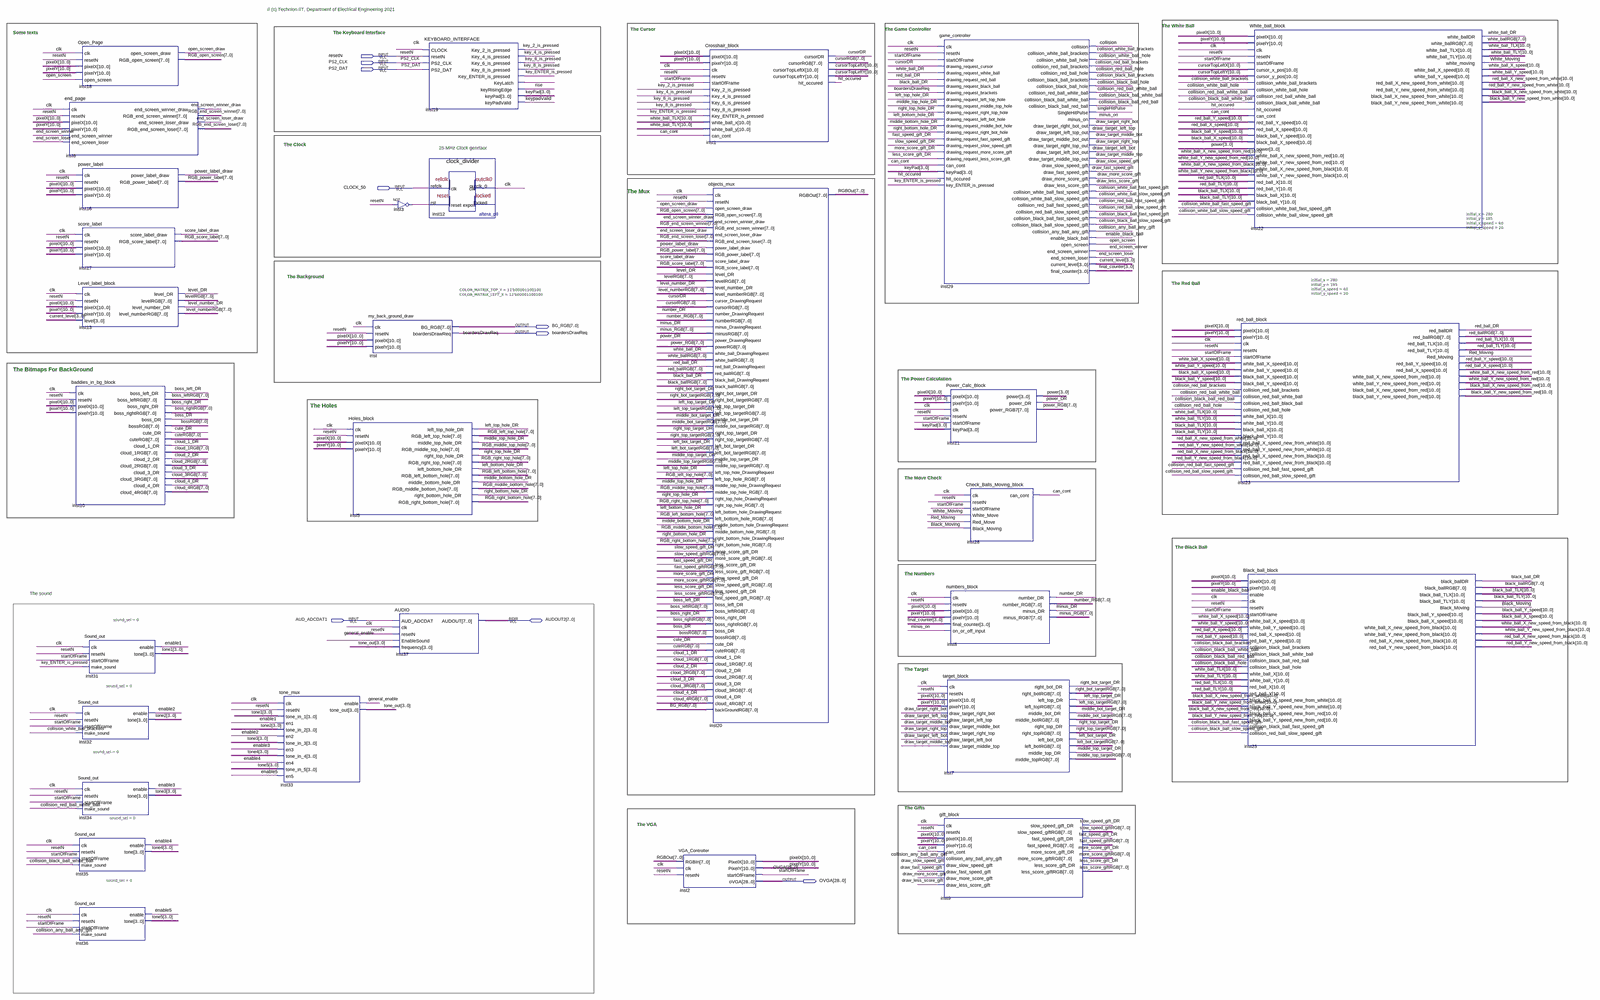
[diagram p0: schematic sheet, whole]
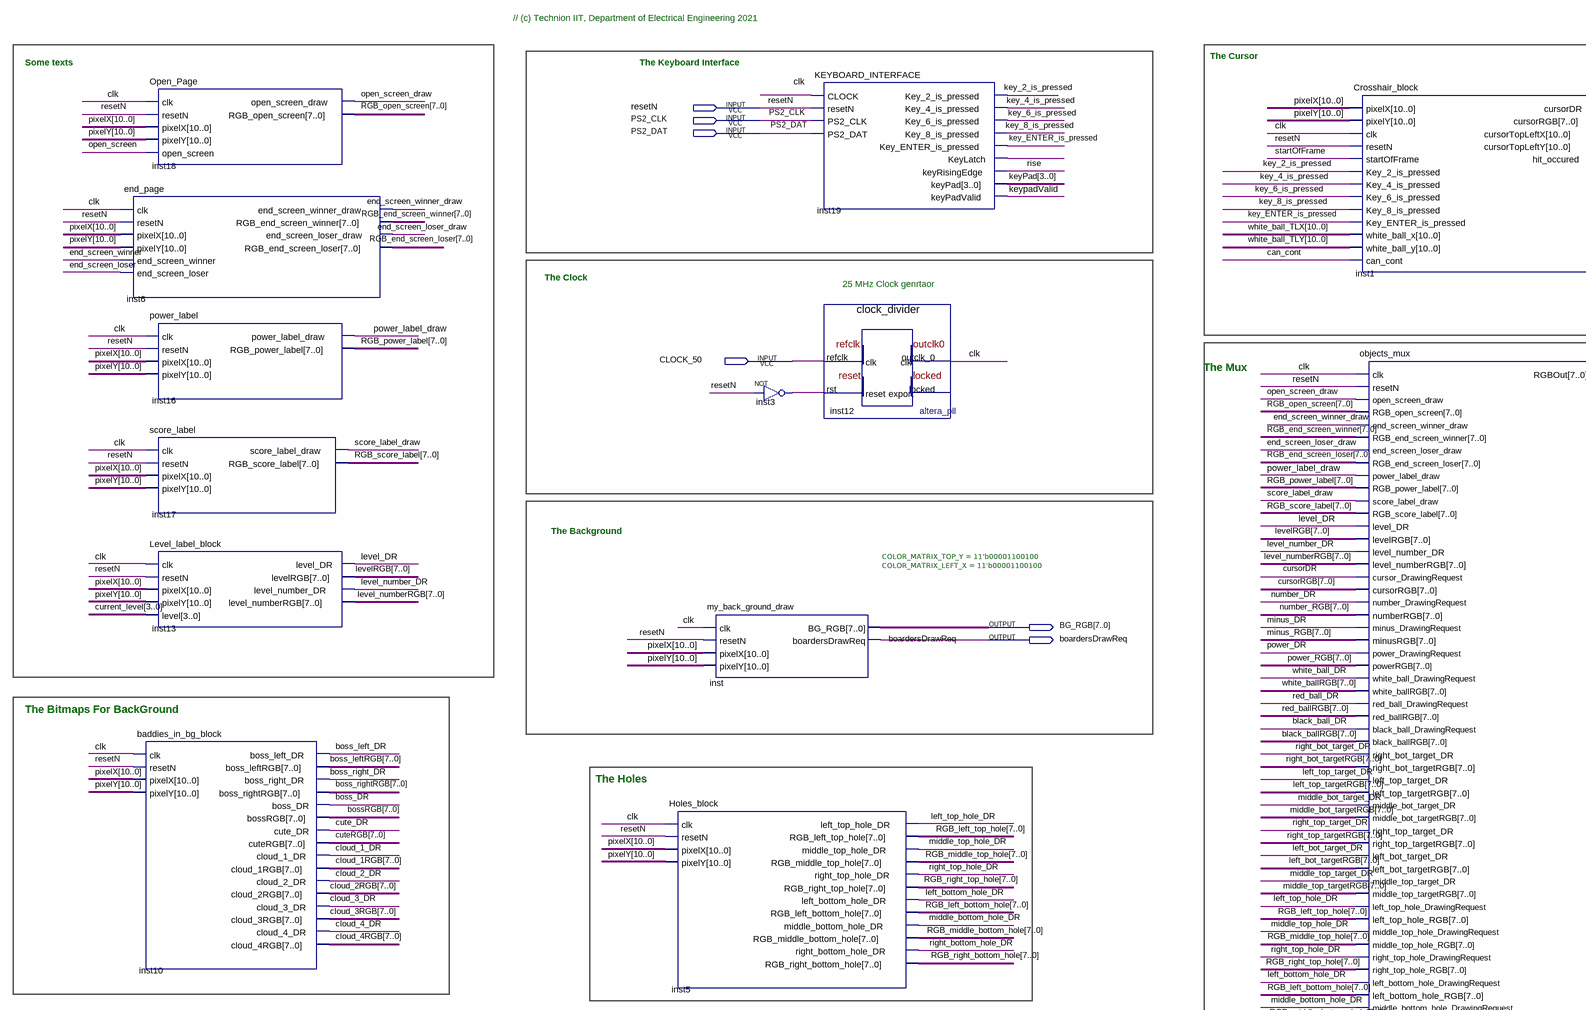
[diagram p1: schematic sheet, upper left part]
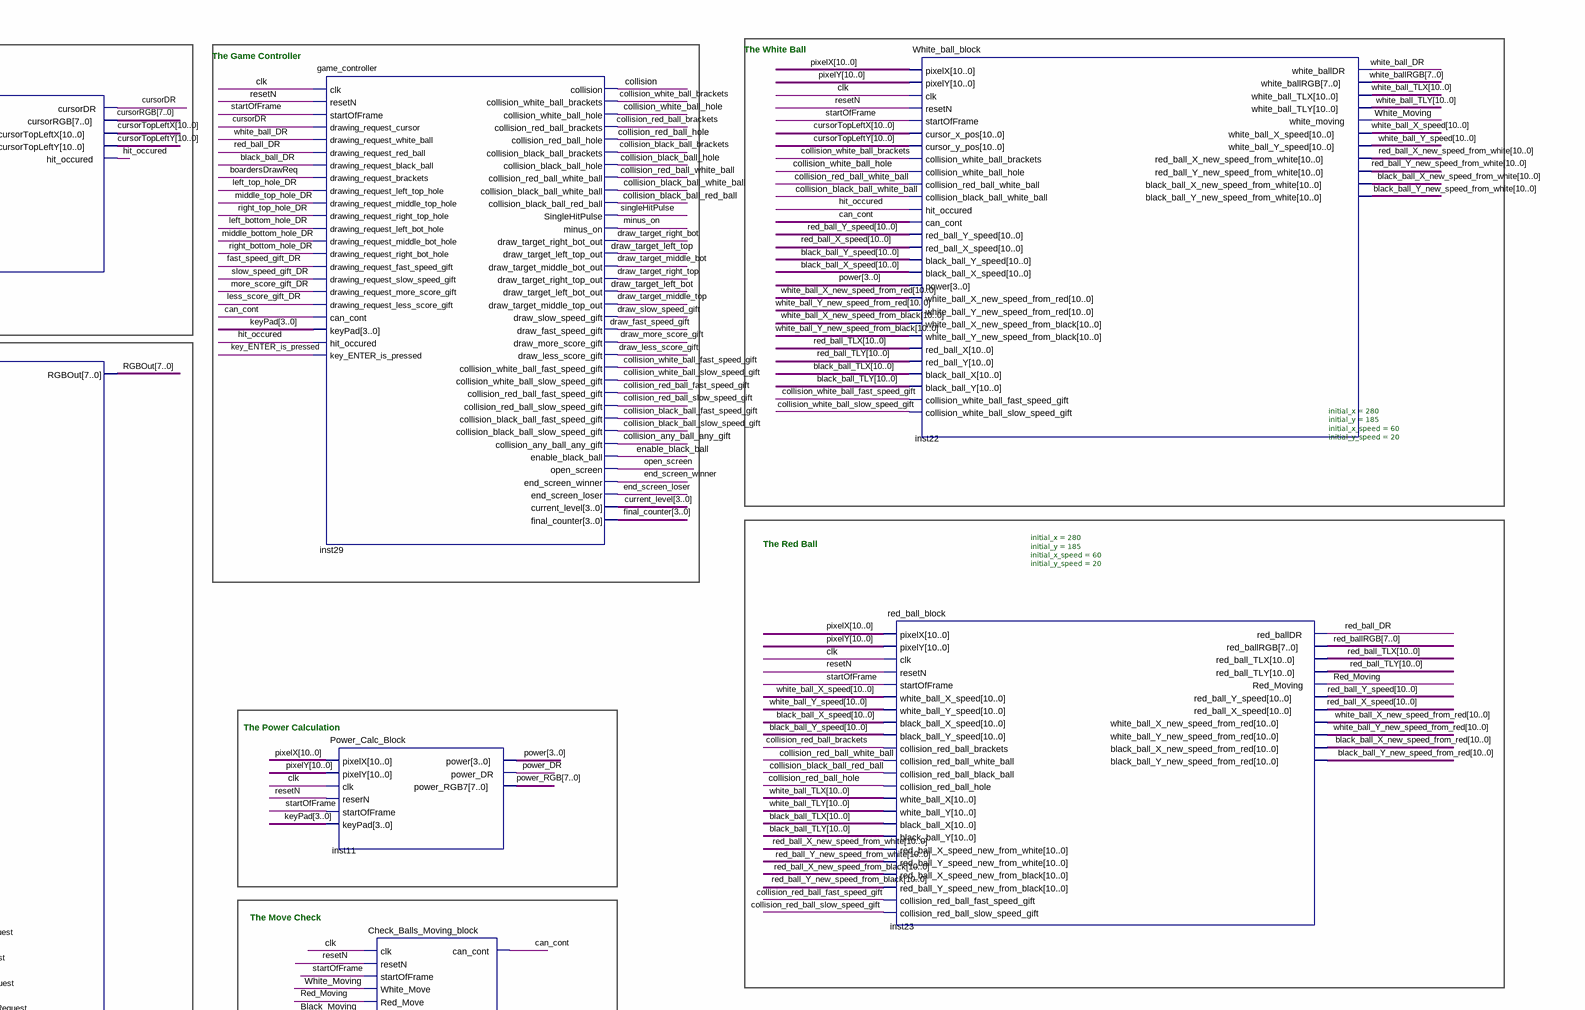
[diagram p2: schematic sheet, upper right part]
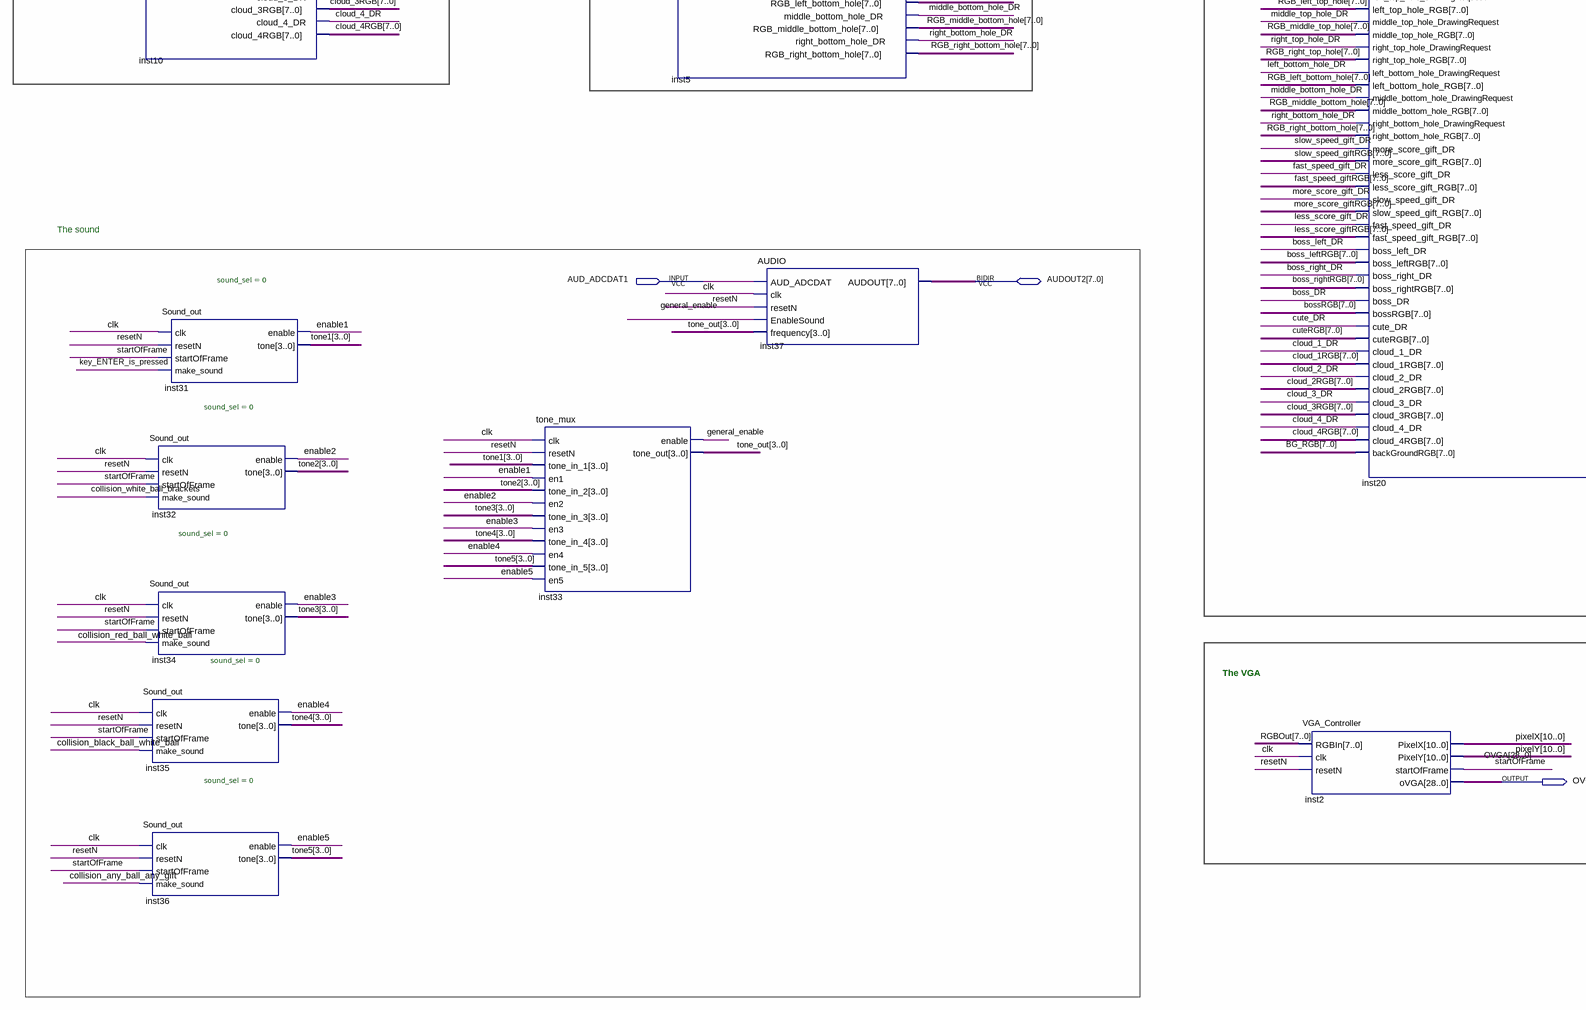
[diagram p3: schematic sheet, lower left part]
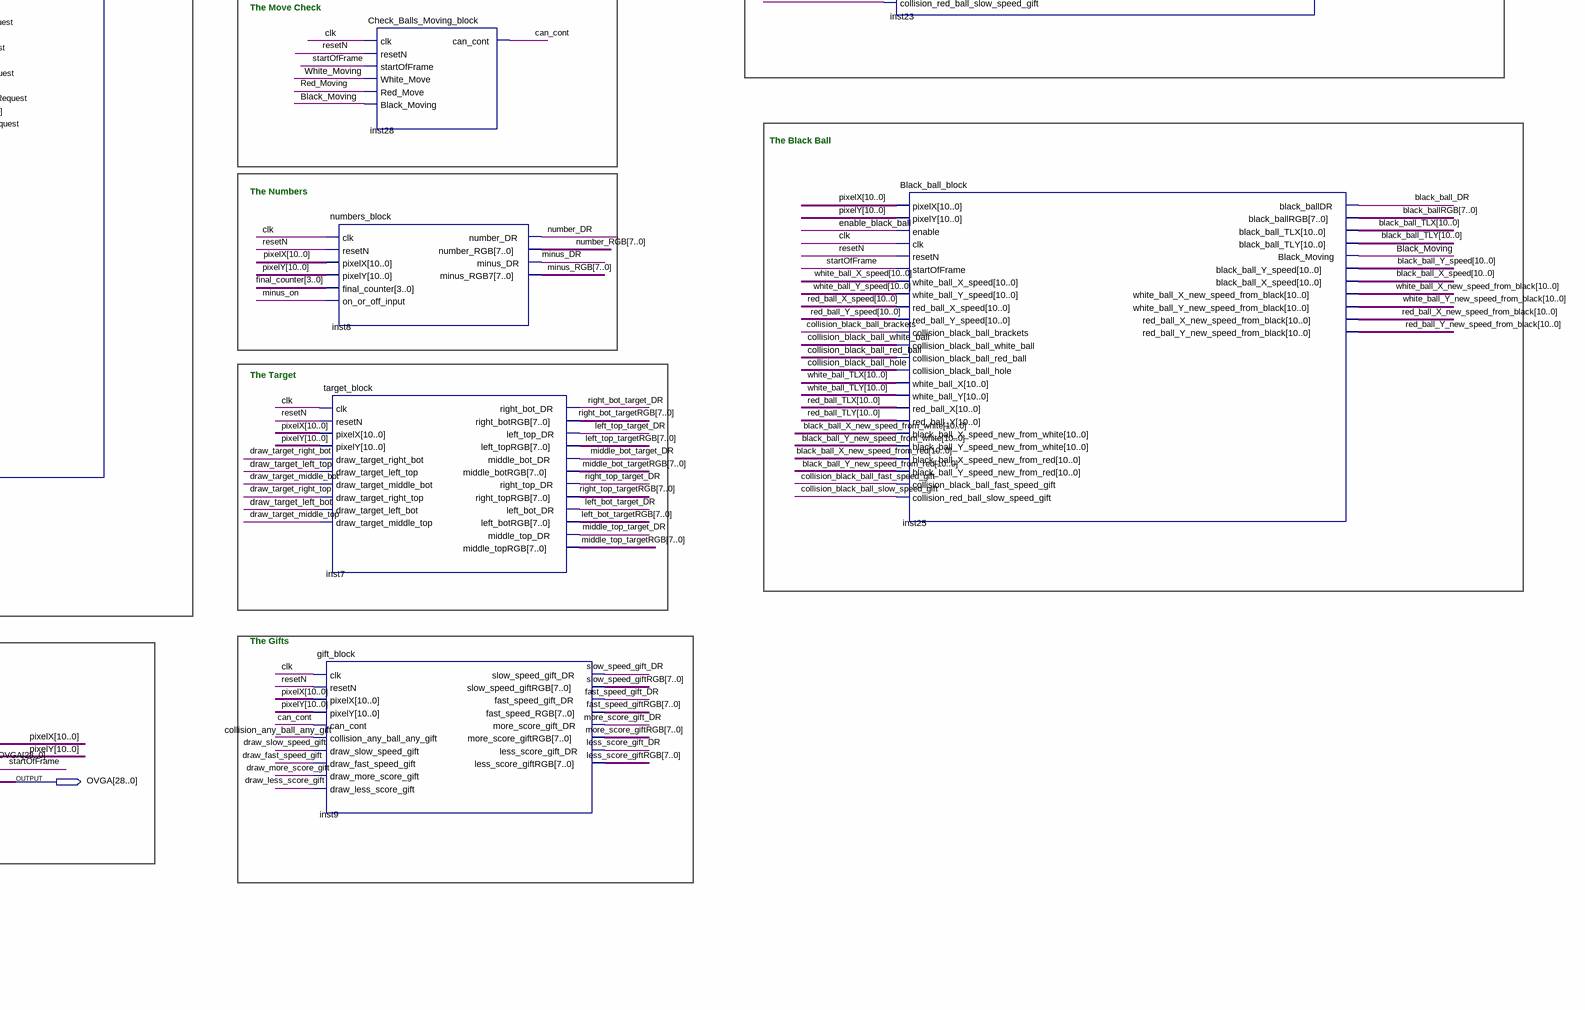
[diagram p4: schematic sheet, lower right part]
// Quartus schematic TOP_VGA_DEMO_KBD.bdf as structural Verilog: 30 symbols, 9 pins
module TOP_VGA_DEMO_KBD (
  input  resetN,
  input  PS2_CLK,
  input  PS2_DAT,
  input  CLOCK_50,
  input  AUD_ADCDAT1,
  inout  [7:0] AUDOUT2,
  output [7:0] BG_RGB,
  output boardersDrawReq,
  output [28:0] OVGA
);

  wire black_ball_DR, Black_Moving, boss_DR, boss_left_DR, boss_right_DR, can_cont, clk, cloud_1_DR,
       cloud_2_DR, cloud_3_DR, cloud_4_DR, collision, collision_any_ball_any_gift,
       collision_black_ball_brackets, collision_black_ball_fast_speed_gift, collision_black_ball_hole,
       collision_black_ball_red_ball, collision_black_ball_slow_speed_gift, collision_black_ball_white_ball,
       collision_red_ball_brackets, collision_red_ball_fast_speed_gift, collision_red_ball_hole,
       collision_red_ball_slow_speed_gift, collision_red_ball_white_ball, collision_white_ball_brackets,
       collision_white_ball_fast_speed_gift, collision_white_ball_hole, collision_white_ball_slow_speed_gift,
       cursorDR, cute_DR, draw_fast_speed_gift, draw_less_score_gift, draw_more_score_gift,
       draw_slow_speed_gift, draw_target_left_bot, draw_target_left_top, draw_target_middle_bot,
       draw_target_middle_top, draw_target_right_bot, draw_target_right_top, enable1, enable2, enable3,
       enable4, enable5, enable_black_ball, end_screen_loser, end_screen_loser_draw, end_screen_winner,
       end_screen_winner_draw, fast_speed_gift_DR, general_enable, hit_occured, inst3_out, inst19_keylatch,
       key_2_is_pressed, key_4_is_pressed, key_6_is_pressed, key_8_is_pressed, key_ENTER_is_pressed,
       keypadValid, left_bot_target_DR, left_bottom_hole_DR, left_top_hole_DR, left_top_target_DR,
       less_score_gift_DR, level_DR, level_number_DR, middle_bot_target_DR, middle_bottom_hole_DR,
       middle_top_hole_DR, middle_top_target_DR, minus_DR, minus_on, more_score_gift_DR, number_DR,
       open_screen, open_screen_draw, power_DR, power_label_draw, red_ball_DR, Red_Moving,
       right_bot_target_DR, right_bottom_hole_DR, right_top_hole_DR, right_top_target_DR, rise,
       score_label_draw, singleHitPulse, slow_speed_gift_DR, startOfFrame, white_ball_DR, White_Moving;
  wire [3:0] current_level, final_counter, keyPad, power, tone1, tone2, tone3, tone4, tone5, tone_out;
  wire [7:0] black_ballRGB, boss_leftRGB, boss_rightRGB, bossRGB, cloud_1RGB, cloud_2RGB, cloud_3RGB,
       cloud_4RGB, cursorRGB, cuteRGB, fast_speed_giftRGB, left_bot_targetRGB, left_top_targetRGB,
       less_score_giftRGB, level_numberRGB, levelRGB, middle_bot_targetRGB, middle_top_targetRGB, minus_RGB,
       more_score_giftRGB, number_RGB, power_RGB, red_ballRGB, RGB_end_screen_loser, RGB_end_screen_winner,
       RGB_left_bottom_hole, RGB_left_top_hole, RGB_middle_bottom_hole, RGB_middle_top_hole, RGB_open_screen,
       RGB_power_label, RGB_right_bottom_hole, RGB_right_top_hole, RGB_score_label, RGBOut,
       right_bot_targetRGB, right_top_targetRGB, slow_speed_giftRGB, white_ballRGB;
  wire [10:0] black_ball_TLX, black_ball_TLY, black_ball_X_new_speed_from_red,
       black_ball_X_new_speed_from_white, black_ball_X_speed, black_ball_Y_new_speed_from_red,
       black_ball_Y_new_speed_from_white, black_ball_Y_speed, cursorTopLeftX, cursorTopLeftY, pixelX, pixelY,
       red_ball_TLX, red_ball_TLY, red_ball_X_new_speed_from_black, red_ball_X_new_speed_from_white,
       red_ball_X_speed, red_ball_Y_new_speed_from_black, red_ball_Y_new_speed_from_white, red_ball_Y_speed,
       white_ball_TLX, white_ball_TLY, white_ball_X_new_speed_from_black, white_ball_X_new_speed_from_red,
       white_ball_X_speed, white_ball_Y_new_speed_from_black, white_ball_Y_new_speed_from_red,
       white_ball_Y_speed;

  Open_Page inst18 (
    .clk(clk), .resetN(resetN), .pixelX(pixelX), .pixelY(pixelY), .open_screen(open_screen),
    .open_screen_draw(open_screen_draw), .RGB_open_screen(RGB_open_screen));
  end_page inst6 (
    .clk(clk), .resetN(resetN), .pixelX(pixelX), .pixelY(pixelY), .end_screen_winner(end_screen_winner),
    .end_screen_loser(end_screen_loser), .end_screen_winner_draw(end_screen_winner_draw),
    .RGB_end_screen_winner(RGB_end_screen_winner), .end_screen_loser_draw(end_screen_loser_draw),
    .RGB_end_screen_loser(RGB_end_screen_loser));
  power_label inst16 (
    .clk(clk), .resetN(resetN), .pixelX(pixelX), .pixelY(pixelY), .power_label_draw(power_label_draw),
    .RGB_power_label(RGB_power_label));
  score_label inst17 (
    .clk(clk), .resetN(resetN), .pixelX(pixelX), .pixelY(pixelY), .score_label_draw(score_label_draw),
    .RGB_score_label(RGB_score_label));
  Level_label_block inst13 (
    .clk(clk), .resetN(resetN), .pixelX(pixelX), .pixelY(pixelY), .level(current_level), .level_DR(level_DR),
    .levelRGB(levelRGB), .level_number_DR(level_number_DR), .level_numberRGB(level_numberRGB));
  baddies_in_bg_block inst10 (
    .clk(clk), .resetN(resetN), .pixelX(pixelX), .pixelY(pixelY), .boss_left_DR(boss_left_DR),
    .boss_leftRGB(boss_leftRGB), .boss_right_DR(boss_right_DR), .boss_rightRGB(boss_rightRGB),
    .boss_DR(boss_DR), .bossRGB(bossRGB), .cute_DR(cute_DR), .cuteRGB(cuteRGB), .cloud_1_DR(cloud_1_DR),
    .cloud_1RGB(cloud_1RGB), .cloud_2_DR(cloud_2_DR), .cloud_2RGB(cloud_2RGB), .cloud_3_DR(cloud_3_DR),
    .cloud_3RGB(cloud_3RGB), .cloud_4_DR(cloud_4_DR), .cloud_4RGB(cloud_4RGB));
  Sound_out #(.sound_sel(0)) inst32 (
    .clk(clk), .resetN(resetN), .startOfFrame(startOfFrame), .make_sound(collision_white_ball_brackets),
    .enable(enable2), .tone(tone2));
  Sound_out #(.sound_sel(0)) inst34 (
    .clk(clk), .resetN(resetN), .startOfFrame(startOfFrame), .make_sound(collision_red_ball_white_ball),
    .enable(enable3), .tone(tone3));
  Sound_out #(.sound_sel(0)) inst35 (
    .clk(clk), .resetN(resetN), .startOfFrame(startOfFrame), .make_sound(collision_black_ball_white_ball),
    .enable(enable4), .tone(tone4));
  Sound_out #(.sound_sel(0)) inst36 (
    .clk(clk), .resetN(resetN), .startOfFrame(startOfFrame), .make_sound(collision_any_ball_any_gift),
    .enable(enable5), .tone(tone5));
  Sound_out #(.sound_sel(0)) inst31 (
    .clk(clk), .resetN(resetN), .startOfFrame(startOfFrame), .make_sound(key_ENTER_is_pressed),
    .enable(enable1), .tone(tone1));
  tone_mux inst33 (
    .clk(clk), .resetN(resetN), .tone_in_1(tone1), .en1(enable1), .tone_in_2(tone2), .en2(enable2),
    .tone_in_3(tone3), .en3(enable3), .tone_in_4(tone4), .en4(enable4), .tone_in_5(tone5), .en5(enable5),
    .enable(general_enable), .tone_out(tone_out));
  my_back_ground_draw #(.COLOR_MATRIX_TOP_Y(11'b00001100100), .COLOR_MATRIX_LEFT_X(11'b00001100100)) inst (
    .clk(clk), .resetN(resetN), .pixelX(pixelX), .pixelY(pixelY), .BG_RGB(BG_RGB),
    .boardersDrawReq(boardersDrawReq));
  Holes_block inst5 (
    .clk(clk), .resetN(resetN), .pixelX(pixelX), .pixelY(pixelY), .left_top_hole_DR(left_top_hole_DR),
    .RGB_left_top_hole(RGB_left_top_hole), .middle_top_hole_DR(middle_top_hole_DR),
    .RGB_middle_top_hole(RGB_middle_top_hole), .right_top_hole_DR(right_top_hole_DR),
    .RGB_right_top_hole(RGB_right_top_hole), .left_bottom_hole_DR(left_bottom_hole_DR),
    .RGB_left_bottom_hole(RGB_left_bottom_hole), .middle_bottom_hole_DR(middle_bottom_hole_DR),
    .RGB_middle_bottom_hole(RGB_middle_bottom_hole), .right_bottom_hole_DR(right_bottom_hole_DR),
    .RGB_right_bottom_hole(RGB_right_bottom_hole));
  not inst3 (inst3_out, resetN);
  AUDIO inst37 (
    .AUD_ADCDAT(AUD_ADCDAT1), .clk(clk), .resetN(resetN), .EnableSound(general_enable), .frequency(tone_out),
    .AUDOUT(AUDOUT2));
  KEYBOARD_INTERFACE inst19 (
    .CLOCK(clk), .resetN(resetN), .PS2_CLK(PS2_CLK), .PS2_DAT(PS2_DAT), .Key_2_is_pressed(key_2_is_pressed),
    .Key_4_is_pressed(key_4_is_pressed), .Key_6_is_pressed(key_6_is_pressed),
    .Key_8_is_pressed(key_8_is_pressed), .Key_ENTER_is_pressed(key_ENTER_is_pressed),
    .KeyLatch(inst19_keylatch), .keyRisingEdge(rise), .keyPad(keyPad), .keyPadValid(keypadValid));
  clock_divider inst12 (.refclk(CLOCK_50), .rst(inst3_out), .outclk_0(clk));  // open: locked
  VGA_Controller inst2 (
    .RGBIn(RGBOut), .clk(clk), .resetN(resetN), .PixelX(pixelX), .PixelY(pixelY),
    .startOfFrame(startOfFrame), .oVGA(OVGA));
  Crosshair_block inst1 (
    .pixelX(pixelX), .pixelY(pixelY), .clk(clk), .resetN(resetN), .startOfFrame(startOfFrame),
    .Key_2_is_pressed(key_2_is_pressed), .Key_4_is_pressed(key_4_is_pressed),
    .Key_6_is_pressed(key_6_is_pressed), .Key_8_is_pressed(key_8_is_pressed),
    .Key_ENTER_is_pressed(key_ENTER_is_pressed), .white_ball_x(white_ball_TLX),
    .white_ball_y(white_ball_TLY), .can_cont(can_cont), .cursorDR(cursorDR), .cursorRGB(cursorRGB),
    .cursorTopLeftX(cursorTopLeftX), .cursorTopLeftY(cursorTopLeftY), .hit_occured(hit_occured));
  objects_mux inst20 (
    .clk(clk), .resetN(resetN), .open_screen_draw(open_screen_draw), .RGB_open_screen(RGB_open_screen),
    .end_screen_winner_draw(end_screen_winner_draw), .RGB_end_screen_winner(RGB_end_screen_winner),
    .end_screen_loser_draw(end_screen_loser_draw), .RGB_end_screen_loser(RGB_end_screen_loser),
    .power_label_draw(power_label_draw), .RGB_power_label(RGB_power_label),
    .score_label_draw(score_label_draw), .RGB_score_label(RGB_score_label), .level_DR(level_DR),
    .levelRGB(levelRGB), .level_number_DR(level_number_DR), .level_numberRGB(level_numberRGB),
    .cursor_DrawingRequest(cursorDR), .cursorRGB(cursorRGB), .number_DrawingRequest(number_DR),
    .numberRGB(number_RGB), .minus_DrawingRequest(minus_DR), .minusRGB(minus_RGB),
    .power_DrawingRequest(power_DR), .powerRGB(power_RGB), .white_ball_DrawingRequest(white_ball_DR),
    .white_ballRGB(white_ballRGB), .red_ball_DrawingRequest(red_ball_DR), .red_ballRGB(red_ballRGB),
    .black_ball_DrawingRequest(black_ball_DR), .black_ballRGB(black_ballRGB),
    .right_bot_target_DR(right_bot_target_DR), .right_bot_targetRGB(right_bot_targetRGB),
    .left_top_target_DR(left_top_target_DR), .left_top_targetRGB(left_top_targetRGB),
    .middle_bot_target_DR(middle_bot_target_DR), .middle_bot_targetRGB(middle_bot_targetRGB),
    .right_top_target_DR(right_top_target_DR), .right_top_targetRGB(right_top_targetRGB),
    .left_bot_target_DR(left_bot_target_DR), .left_bot_targetRGB(left_bot_targetRGB),
    .middle_top_target_DR(middle_top_target_DR), .middle_top_targetRGB(middle_top_targetRGB),
    .left_top_hole_DrawingRequest(left_top_hole_DR), .left_top_hole_RGB(RGB_left_top_hole),
    .middle_top_hole_DrawingRequest(middle_top_hole_DR), .middle_top_hole_RGB(RGB_middle_top_hole),
    .right_top_hole_DrawingRequest(right_top_hole_DR), .right_top_hole_RGB(RGB_right_top_hole),
    .left_bottom_hole_DrawingRequest(left_bottom_hole_DR), .left_bottom_hole_RGB(RGB_left_bottom_hole),
    .middle_bottom_hole_DrawingRequest(middle_bottom_hole_DR),
    .middle_bottom_hole_RGB(RGB_middle_bottom_hole), .right_bottom_hole_DrawingRequest(right_bottom_hole_DR),
    .right_bottom_hole_RGB(RGB_right_bottom_hole), .more_score_gift_DR(slow_speed_gift_DR),
    .more_score_gift_RGB(slow_speed_giftRGB), .less_score_gift_DR(fast_speed_gift_DR),
    .less_score_gift_RGB(fast_speed_giftRGB), .slow_speed_gift_DR(more_score_gift_DR),
    .slow_speed_gift_RGB(more_score_giftRGB), .fast_speed_gift_DR(less_score_gift_DR),
    .fast_speed_gift_RGB(less_score_giftRGB), .boss_left_DR(boss_left_DR), .boss_leftRGB(boss_leftRGB),
    .boss_right_DR(boss_right_DR), .boss_rightRGB(boss_rightRGB), .boss_DR(boss_DR), .bossRGB(bossRGB),
    .cute_DR(cute_DR), .cuteRGB(cuteRGB), .cloud_1_DR(cloud_1_DR), .cloud_1RGB(cloud_1RGB),
    .cloud_2_DR(cloud_2_DR), .cloud_2RGB(cloud_2RGB), .cloud_3_DR(cloud_3_DR), .cloud_3RGB(cloud_3RGB),
    .cloud_4_DR(cloud_4_DR), .cloud_4RGB(cloud_4RGB), .backGroundRGB(BG_RGB), .RGBOut(RGBOut));
  game_controller inst29 (
    .clk(clk), .resetN(resetN), .startOfFrame(startOfFrame), .drawing_request_cursor(cursorDR),
    .drawing_request_white_ball(white_ball_DR), .drawing_request_red_ball(red_ball_DR),
    .drawing_request_black_ball(black_ball_DR), .drawing_request_brackets(boardersDrawReq),
    .drawing_request_left_top_hole(left_top_hole_DR), .drawing_request_middle_top_hole(middle_top_hole_DR),
    .drawing_request_right_top_hole(right_top_hole_DR), .drawing_request_left_bot_hole(left_bottom_hole_DR),
    .drawing_request_middle_bot_hole(middle_bottom_hole_DR),
    .drawing_request_right_bot_hole(right_bottom_hole_DR),
    .drawing_request_fast_speed_gift(fast_speed_gift_DR),
    .drawing_request_slow_speed_gift(slow_speed_gift_DR),
    .drawing_request_more_score_gift(more_score_gift_DR),
    .drawing_request_less_score_gift(less_score_gift_DR), .can_cont(can_cont), .keyPad(keyPad),
    .hit_occured(hit_occured), .key_ENTER_is_pressed(key_ENTER_is_pressed), .collision(collision),
    .collision_white_ball_brackets(collision_white_ball_brackets),
    .collision_white_ball_hole(collision_white_ball_hole),
    .collision_red_ball_brackets(collision_red_ball_brackets),
    .collision_red_ball_hole(collision_red_ball_hole),
    .collision_black_ball_brackets(collision_black_ball_brackets),
    .collision_black_ball_hole(collision_black_ball_hole),
    .collision_red_ball_white_ball(collision_red_ball_white_ball),
    .collision_black_ball_white_ball(collision_black_ball_white_ball),
    .collision_black_ball_red_ball(collision_black_ball_red_ball), .SingleHitPulse(singleHitPulse),
    .minus_on(minus_on), .draw_target_right_bot_out(draw_target_right_bot),
    .draw_target_left_top_out(draw_target_left_top), .draw_target_middle_bot_out(draw_target_middle_bot),
    .draw_target_right_top_out(draw_target_right_top), .draw_target_left_bot_out(draw_target_left_bot),
    .draw_target_middle_top_out(draw_target_middle_top), .draw_slow_speed_gift(draw_slow_speed_gift),
    .draw_fast_speed_gift(draw_fast_speed_gift), .draw_more_score_gift(draw_more_score_gift),
    .draw_less_score_gift(draw_less_score_gift),
    .collision_white_ball_fast_speed_gift(collision_white_ball_fast_speed_gift),
    .collision_white_ball_slow_speed_gift(collision_white_ball_slow_speed_gift),
    .collision_red_ball_fast_speed_gift(collision_red_ball_fast_speed_gift),
    .collision_red_ball_slow_speed_gift(collision_red_ball_slow_speed_gift),
    .collision_black_ball_fast_speed_gift(collision_black_ball_fast_speed_gift),
    .collision_black_ball_slow_speed_gift(collision_black_ball_slow_speed_gift),
    .collision_any_ball_any_gift(collision_any_ball_any_gift), .enable_black_ball(enable_black_ball),
    .open_screen(open_screen), .end_screen_winner(end_screen_winner), .end_screen_loser(end_screen_loser),
    .current_level(current_level), .final_counter(final_counter));
  Power_Calc_Block inst11 (
    .pixelX(pixelX), .pixelY(pixelY), .clk(clk), .reserN(resetN), .startOfFrame(startOfFrame),
    .keyPad(keyPad), .power(power), .power_DR(power_DR), .power_RGB7(power_RGB));
  numbers_block inst8 (
    .clk(clk), .resetN(resetN), .pixelX(pixelX), .pixelY(pixelY), .final_counter(final_counter),
    .on_or_off_input(minus_on), .number_DR(number_DR), .number_RGB(number_RGB), .minus_DR(minus_DR),
    .minus_RGB7(minus_RGB));
  target_block inst7 (
    .clk(clk), .resetN(resetN), .pixelX(pixelX), .pixelY(pixelY),
    .draw_target_right_bot(draw_target_right_bot), .draw_target_left_top(draw_target_left_top),
    .draw_target_middle_bot(draw_target_middle_bot), .draw_target_right_top(draw_target_right_top),
    .draw_target_left_bot(draw_target_left_bot), .draw_target_middle_top(draw_target_middle_top),
    .right_bot_DR(right_bot_target_DR), .right_botRGB(right_bot_targetRGB), .left_top_DR(left_top_target_DR),
    .left_topRGB(left_top_targetRGB), .middle_bot_DR(middle_bot_target_DR),
    .middle_botRGB(middle_bot_targetRGB), .right_top_DR(right_top_target_DR),
    .right_topRGB(right_top_targetRGB), .left_bot_DR(left_bot_target_DR), .left_botRGB(left_bot_targetRGB),
    .middle_top_DR(middle_top_target_DR), .middle_topRGB(middle_top_targetRGB));
  gift_block inst9 (
    .clk(clk), .resetN(resetN), .pixelX(pixelX), .pixelY(pixelY), .can_cont(can_cont),
    .collision_any_ball_any_gift(collision_any_ball_any_gift), .draw_slow_speed_gift(draw_slow_speed_gift),
    .draw_fast_speed_gift(draw_fast_speed_gift), .draw_more_score_gift(draw_more_score_gift),
    .draw_less_score_gift(draw_less_score_gift), .slow_speed_gift_DR(slow_speed_gift_DR),
    .slow_speed_giftRGB(slow_speed_giftRGB), .fast_speed_gift_DR(fast_speed_gift_DR),
    .fast_speed_RGB(fast_speed_giftRGB), .more_score_gift_DR(more_score_gift_DR),
    .more_score_giftRGB(more_score_giftRGB), .less_score_gift_DR(less_score_gift_DR),
    .less_score_giftRGB(less_score_giftRGB));
  Check_Balls_Moving_block inst28 (
    .clk(clk), .resetN(resetN), .startOfFrame(startOfFrame), .White_Move(White_Moving),
    .Red_Move(Red_Moving), .Black_Moving(Black_Moving), .can_cont(can_cont));
  red_ball_block #(.initial_x(280), .initial_y(185), .initial_x_speed(60), .initial_y_speed(20)) inst23 (
    .pixelX(pixelX), .pixelY(pixelY), .clk(clk), .resetN(resetN), .startOfFrame(startOfFrame),
    .white_ball_X_speed(white_ball_X_speed), .white_ball_Y_speed(white_ball_Y_speed),
    .black_ball_X_speed(black_ball_X_speed), .black_ball_Y_speed(black_ball_Y_speed),
    .collision_red_ball_brackets(collision_red_ball_brackets),
    .collision_red_ball_white_ball(collision_red_ball_white_ball),
    .collision_red_ball_black_ball(collision_black_ball_red_ball),
    .collision_red_ball_hole(collision_red_ball_hole), .white_ball_X(white_ball_TLX),
    .white_ball_Y(white_ball_TLY), .black_ball_X(black_ball_TLX), .black_ball_Y(black_ball_TLY),
    .red_ball_X_speed_new_from_white(red_ball_X_new_speed_from_white),
    .red_ball_Y_speed_new_from_white(red_ball_Y_new_speed_from_white),
    .red_ball_X_speed_new_from_black(red_ball_X_new_speed_from_black),
    .red_ball_Y_speed_new_from_black(red_ball_Y_new_speed_from_black),
    .collision_red_ball_fast_speed_gift(collision_red_ball_fast_speed_gift),
    .collision_red_ball_slow_speed_gift(collision_red_ball_slow_speed_gift), .red_ballDR(red_ball_DR),
    .red_ballRGB(red_ballRGB), .red_ball_TLX(red_ball_TLX), .red_ball_TLY(red_ball_TLY),
    .Red_Moving(Red_Moving), .red_ball_Y_speed(red_ball_Y_speed), .red_ball_X_speed(red_ball_X_speed),
    .white_ball_X_new_speed_from_red(white_ball_X_new_speed_from_red),
    .white_ball_Y_new_speed_from_red(white_ball_Y_new_speed_from_red),
    .black_ball_X_new_speed_from_red(black_ball_X_new_speed_from_red),
    .black_ball_Y_new_speed_from_red(black_ball_Y_new_speed_from_red));
  White_ball_block #(.initial_x(280), .initial_y(185), .initial_x_speed(60), .initial_y_speed(20)) inst22 (
    .pixelX(pixelX), .pixelY(pixelY), .clk(clk), .resetN(resetN), .startOfFrame(startOfFrame),
    .cursor_x_pos(cursorTopLeftX), .cursor_y_pos(cursorTopLeftY),
    .collision_white_ball_brackets(collision_white_ball_brackets),
    .collision_white_ball_hole(collision_white_ball_hole),
    .collision_red_ball_white_ball(collision_red_ball_white_ball),
    .collision_black_ball_white_ball(collision_black_ball_white_ball), .hit_occured(hit_occured),
    .can_cont(can_cont), .red_ball_Y_speed(red_ball_Y_speed), .red_ball_X_speed(red_ball_X_speed),
    .black_ball_Y_speed(black_ball_Y_speed), .black_ball_X_speed(black_ball_X_speed), .power(power),
    .white_ball_X_new_speed_from_red(white_ball_X_new_speed_from_red),
    .white_ball_Y_new_speed_from_red(white_ball_Y_new_speed_from_red),
    .white_ball_X_new_speed_from_black(white_ball_X_new_speed_from_black),
    .white_ball_Y_new_speed_from_black(white_ball_Y_new_speed_from_black), .red_ball_X(red_ball_TLX),
    .red_ball_Y(red_ball_TLY), .black_ball_X(black_ball_TLX), .black_ball_Y(black_ball_TLY),
    .collision_white_ball_fast_speed_gift(collision_white_ball_fast_speed_gift),
    .collision_white_ball_slow_speed_gift(collision_white_ball_slow_speed_gift),
    .white_ballDR(white_ball_DR), .white_ballRGB(white_ballRGB), .white_ball_TLX(white_ball_TLX),
    .white_ball_TLY(white_ball_TLY), .white_moving(White_Moving), .white_ball_X_speed(white_ball_X_speed),
    .white_ball_Y_speed(white_ball_Y_speed),
    .red_ball_X_new_speed_from_white(red_ball_X_new_speed_from_white),
    .red_ball_Y_new_speed_from_white(red_ball_Y_new_speed_from_white),
    .black_ball_X_new_speed_from_white(black_ball_X_new_speed_from_white),
    .black_ball_Y_new_speed_from_white(black_ball_Y_new_speed_from_white));
  Black_ball_block inst25 (
    .pixelX(pixelX), .pixelY(pixelY), .enable(enable_black_ball), .clk(clk), .resetN(resetN),
    .startOfFrame(startOfFrame), .white_ball_X_speed(white_ball_X_speed),
    .white_ball_Y_speed(white_ball_Y_speed), .red_ball_X_speed(red_ball_X_speed),
    .red_ball_Y_speed(red_ball_Y_speed), .collision_black_ball_brackets(collision_black_ball_brackets),
    .collision_black_ball_white_ball(collision_black_ball_white_ball),
    .collision_black_ball_red_ball(collision_black_ball_red_ball),
    .collision_black_ball_hole(collision_black_ball_hole), .white_ball_X(white_ball_TLX),
    .white_ball_Y(white_ball_TLY), .red_ball_X(red_ball_TLX), .red_ball_Y(red_ball_TLY),
    .black_ball_X_speed_new_from_white(black_ball_X_new_speed_from_white),
    .black_ball_Y_speed_new_from_white(black_ball_Y_new_speed_from_white),
    .black_ball_X_speed_new_from_red(black_ball_X_new_speed_from_red),
    .black_ball_Y_speed_new_from_red(black_ball_Y_new_speed_from_red),
    .collision_black_ball_fast_speed_gift(collision_black_ball_fast_speed_gift),
    .collision_red_ball_slow_speed_gift(collision_black_ball_slow_speed_gift), .black_ballDR(black_ball_DR),
    .black_ballRGB(black_ballRGB), .black_ball_TLX(black_ball_TLX), .black_ball_TLY(black_ball_TLY),
    .Black_Moving(Black_Moving), .black_ball_Y_speed(black_ball_Y_speed),
    .black_ball_X_speed(black_ball_X_speed),
    .white_ball_X_new_speed_from_black(white_ball_X_new_speed_from_black),
    .white_ball_Y_new_speed_from_black(white_ball_Y_new_speed_from_black),
    .red_ball_X_new_speed_from_black(red_ball_X_new_speed_from_black),
    .red_ball_Y_new_speed_from_black(red_ball_Y_new_speed_from_black));

  // Notes on the sheet:
  //   // (c) Technion IIT, Department of Electrical Engineering 2021
  //   The White Ball
  //   The Cursor
  //   The Game Controller
  //   Some texts
  //   The Keyboard Interface
  //   The Clock
  //   25 MHz Clock genrtaor
  //   The Mux
  //   The Background
  //   The Red Ball
  //   The Bitmaps For BackGround
  //   The Power Calculation
  //   The Holes
  //   The Move Check
  //   The Black Ball
  //   The Numbers
  //   The sound
  //   The Target
  //   The Gifts
  //   The VGA
endmodule
